# EAGLE design battery_charger (EAGLE 6.4)
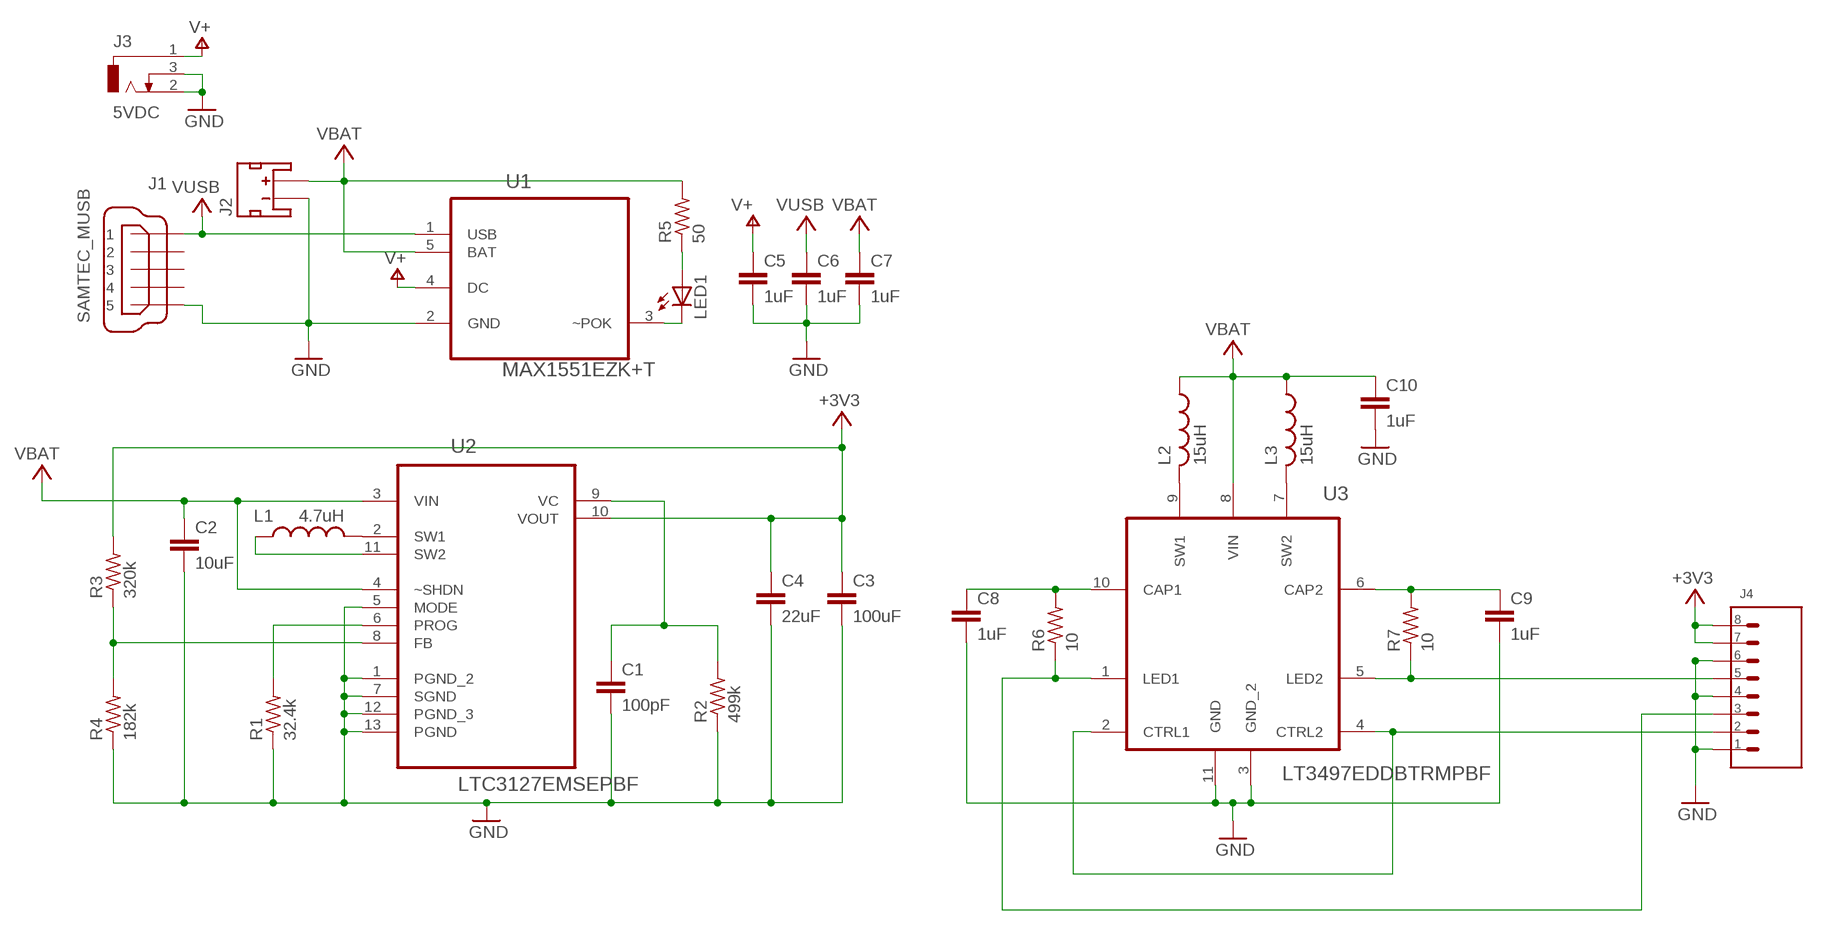
[diagram p0: schematic, sheet 1]

## Parts
C1  100pF  C-EUC0402  [C0402]
C2  10uF  C-EUC0402  [C0402]
C3  100uF  C-EUC1206  [C1206]
C4  22uF  C-EUC0805  [C0805]
C5  1uF  C-EUC0402  [C0402]
C6  1uF  C-EUC0402  [C0402]
C7  1uF  C-EUC0402  [C0402]
C8  1uF  C-EUC0805  [C0805]
C9  1uF  C-EUC0805  [C0805]
C10  1uF  C-EUC0402  [C0402]
J1  SAMTEC_MUSB  [MUSB-05-X-B-SM-A]
J2  JST_2MM_SMT  [JST_2MM_SMT]
J3  5VDC  DC_POWER_JACK_PJ-045  [PJ-045]
J4  IO  8PIN_SIP_.100IN  [8-PIN_SIP_.100IN]
L1  4.7uH  INDUCTOR_NR6028  [NR6028]
L2  15uH  L-USL3225M  [L3225M]
L3  15uH  L-USL3225M  [L3225M]
LED1  CHG  LEDCHIPLED_0603  [CHIPLED_0603]
R1  32.4k  R-US_R0402  [R0402]
R2  499k  R-US_R0402  [R0402]
R3  320k  R-US_R0402  [R0402]
R4  182k  R-US_R0402  [R0402]
R5  50  R-US_R0402  [R0402]
R6  10  R-US_R0402  [R0402]
R7  10  R-US_R0402  [R0402]
U1  MAX1551EZK+T  [SOT95P275X110-5N]
U2  LTC3127EMSEPBF  [SOP65P490X110-13N]
U3  LT3497EDDBTRMPBF  [DFN300X200X80-11N]

## Nets
+3V3: C3.1 C4.1 J4.7(S7) J4.8(S8) R3.2 U2.10(VOUT)
+VBAT: C2.1 C7.1 C10.1 J2.2(+) L2.1 L3.1 R5.2 U1.5(BAT) U2.3(VIN) U2.4(~SHDN) U3.8(VIN) ; supply symbol labelled VBAT
+VUSB: C6.1 J1.1 U1.1(USB) ; supply symbol labelled VUSB
GND: C1.2 C2.2 C3.2 C4.2 C5.2 C6.2 C7.2 C8.2 C9.2 C10.2 J1.5 J2.1(-) J3.2 J3.3 J4.1(S1) J4.4(S4) J4.6(S6) R1.1 R2.1 R4.1 U1.2(GND) U2.1(PGND_2) U2.5(MODE) U2.7(SGND) U2.12(PGND_3) U2.13(PGND) U3.3(GND_2) U3.11(GND)
N$1: R1.2 U2.6(PROG)
N$2: R3.1 R4.2 U2.8(FB)
N$3: L1.2 U2.2(SW1)
N$4: L1.1 U2.11(SW2)
N$5: LED1.C U1.3(~POK)
N$6: C8.1 R6.2 U3.10(CAP1)
N$7: C1.1 R2.2 U2.9(VC)
N$8: LED1.A R5.1
N$9: J4.3(S3) R6.1 U3.1(LED1)
N$10: J4.5(S5) R7.1 U3.5(LED2)
N$11: C9.1 R7.2 U3.6(CAP2)
N$12: L2.2 U3.9(SW1)
N$13: L3.2 U3.7(SW2)
N$14: J4.2(S2) U3.2(CTRL1) U3.4(CTRL2)
V+: C5.1 J3.1 U1.4(DC)
Unconnected: J1.2 J1.3 J1.4

## Library data of the parts
C1-C10 = rcl:C-EU: CAPACITOR, European symbol
J1 = Custom:SAMTEC_MUSB
J2 = Custom:JST_2MM_SMT
J3 = Custom:DC_POWER_JACK_PJ-045
J4 = Custom:8PIN_SIP_.100IN
L1 = Custom:INDUCTOR_NR6028
L2 L3 = rcl:L-US: INDUCTOR, American symbol
LED1 = led:LED: LED OSRAM: - CHIPLED LG R971, LG N971, LY N971, LG Q971, LY Q971, LO R971, LY R971 LH N974, LH R974 LS Q976, LO Q976, LY Q976 LO Q996 - Hyper CHIPLED LW Q18S LB Q993, LB Q99A, LB R99A - SideLED LS A670, LO A670, LY A670, LG A670, LP A670 LB A673, LV A673, LT A673, LW A673 LH A674 LY A675 LS A676, LA A676, LO A676, LY A676, LW A676 LS A679, LY A679, LG A679 - Hyper Micro SIDELED® LS Y876, LA Y876, LO Y876, LY Y876 LT Y87S - SmartLED LW L88C, LW L88S LB L89C, LB L89S, LG L890 LS L89K, LO L89K, LY L89K LS L896, LA L896, LO L896, LY L896 - TOPLED LS T670, LO T670, LY T670, LG T670, LP T670 LSG T670, LSP T670, LSY T670, LOP T670, LYG T670 LG T671, LOG T671, LSG T671 LB T673, LV T673, LT T673, LW T673 LH T674 LS T676, LA T676, LO T676, LY T676, LB T676, LH T676, LSB T676, LW T676 LB T67C, LV T67C, LT T67C, LS T67K, LO T67K, LY T67K, LW E67C LS E67B, LA E67B, LO E67B, LY E67B, LB E67C, LV E67C, LT E67C LW T67C LS T679, LY T679, LG T679 LS T770, LO T770, LY T770, LG T770, LP T770 LB T773, LV T773, LT T773, LW T773 LH T774 LS E675, LA E675, LY E675, LS T675 LS T776, LA T776, LO T776, LY T776, LB T776 LHGB T686 LT T68C, LB T68C - Hyper Mini TOPLED® LB M676 - Mini TOPLED Santana® LG M470 LS M47K, LO M47K, LY M47K Source: http://www.osram.convergy.de LUXEON: - LUMILED® LXK2-PW12-R00, LXK2-PW12-S00, LXK2-PW14-U00, LXK2-PW14-V00 LXK2-PM12-R00, LXK2-PM12-S00, LXK2-PM14-U00 LXK2-PE12-Q00, LXK2-PE12-R00, LXK2-PE12-S00, LXK2-PE14-T00, LXK2-PE14-U00 LXK2-PB12-K00, LXK2-PB12-L00, LXK2-PB12-M00, LXK2-PB14-N00, LXK2-PB14-P00, LXK2-PB14-Q00 LXK2-PR12-L00, LXK2-PR12-M00, LXK2-PR14-Q00, LXK2-PR14-R00 LXK2-PD12-Q00, LXK2-PD12-R00, LXK2-PD12-S00 LXK2-PH12-R00, LXK2-PH12-S00 LXK2-PL12-P00, LXK2-PL12-Q00, LXK2-PL12-R00 Source: www.luxeon.com KINGBRIGHT: KA-3528ASYC Source: www.kingbright.com
R1-R7 = rcl:R-US_: RESISTOR, American symbol
U1 = Maxim:MAX1551EZK+T: SOT23 Dual-Input USB/AC Adapter 1-Cell Li+ Battery Chargers; MPN: MAX1551EZK+T; OC_FARNELL: 1628221; OC_NEWARK: 59J2760; PACKAGE: SOT-23-5; SUPPLIER: Maxim
U2 = LTC:LTC3127EMSEPBF: 1A Buck-Boost DC/DC Converter with Programmable Input Current Limit; MANUFACTURER: LTC3127EMSE#PBF; OC_FARNELL: 1801165; OC_NEWARK: 67R4282; PACKAGE: MSOP-12; SUPPLIER: Linear Technology
U3 = LTC:LT3497EDDBTRMPBF: Dual Full Function White LED Driver with Integrated Schottky Diodes; MPN: LT3497EDDB#TRMPBF; OC_FARNELL: 1715222; OC_NEWARK: 88M1943; PACKAGE: DFN-10; SUPPLIER: Linear Technology

## Board
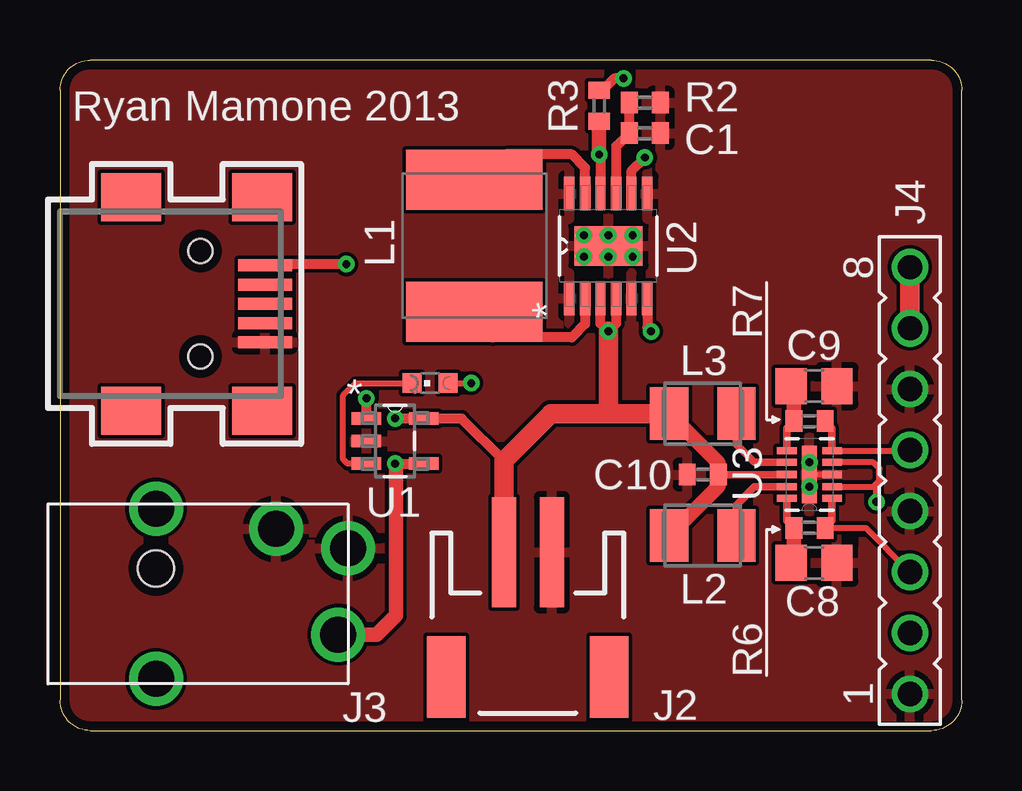
[diagram p1: board, top side]
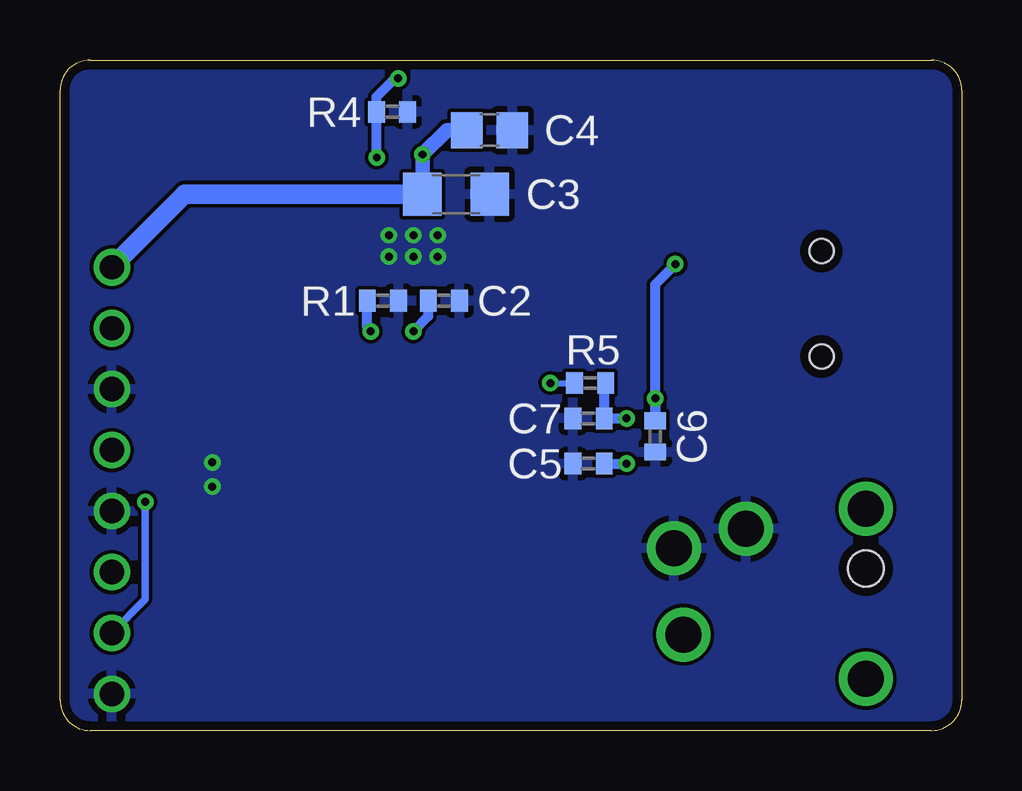
[diagram p2: board, bottom side, seen from below]

Size 37.59 x 27.94 mm. Coordinates in mm from the lower left corner, seen from the top.
Outline: 1.27,0 36.32,0 arc90 37.59,1.27 37.59,26.67 arc90 36.32,27.94 1.27,27.94 arc90 0,26.67 0,1.27 arc90 1.27,0
Copper layers (1*16): Top 0.0356mm / dielectric 1.5011mm / Bottom 0.0356mm
Design rules "LaenPCBOrder_tented_vias": minimum track width 6mil, minimum drill 13mil, track to track 6mil, track to pad 6mil, pad to pad 6mil, via to via 6mil, smd to smd 6mil, copper to edge 15mil, drill to drill 6mil, minimum pad ring 7mil, minimum via ring 7mil, stop-mask expansion 4mil, vias tented up to drill 13mil, thermal gap 10mil

### Footprints (pad centres in the part's own frame; a part is rotated, then mirrored left to right if it is on the bottom)
C0402 = smd 0.7 x 0.9: 1 -0.65,0; 2 0.65,0
C1206 = smd 1.6 x 1.8: 1 -1.4,0; 2 1.4,0
C0805 = smd 1.3 x 1.5: 1 -0.95,0; 2 0.95,0
MUSB-05-X-B-SM-A = smd 0.5 x 2.25: 1 -1.6,8.545; 2 -0.8,8.545; 3 0,8.545; 4 0.8,8.545; 5 1.6,8.545 | smd 2 x 2.5: 8 -4.45,2.97; 9 4.45,2.97; 10 -4.45,8.42; 11 4.45,8.42 | hole 1: -2.2,5.85; 2.2,5.85
JST_2MM_SMT = smd 1 x 4.6: 1 -1,-2.43; 2 1,-2.43 | smd 1.6 x 3.4: NC1 -3.4,2.77; NC2 3.4,2.77
PJ-045 = drill 1.5: 1 1,2.6; 2 -3.4,0; 3 -2.6,3; 4 -4.25,-5; 5 2.85,-5 | hole 1.5: -1.75,-5
8-PIN_SIP_.100IN = drill 1.016: 1 -8.89,0; 2 -6.35,0; 3 -3.81,0; 4 -1.27,0; 5 1.27,0; 6 3.81,0; 7 6.35,0; 8 8.89,0
NR6028 = smd 2.5 x 5.7: 1 -2.75,0; 2 2.75,0
L3225M = smd 1.6 x 2.2: 1 -1.4,0; 2 1.4,0
CHIPLED_0603 = smd 0.8 x 0.8: A 0,-0.75; C 0,0.75
R0402 = smd 0.7 x 0.9: 1 -0.65,0; 2 0.65,0
SOT95P275X110-5N = smd 1.219 x 0.508: 1 -1.194,0.94; 2 -1.194,0; 3 -1.194,-0.94; 4 1.194,-0.94; 5 1.194,0.94
SOP65P490X110-13N = smd 1.397 x 0.432: 1 -2.184,1.626; 2 -2.184,0.965; 3 -2.184,0.33; 4 -2.184,-0.33; 5 -2.184,-0.965; 6 -2.184,-1.626; 7 2.184,-1.626; 8 2.184,-0.965; 9 2.184,-0.33; 10 2.184,0.33; 11 2.184,0.965; 12 2.184,1.626 | smd 1.651 x 2.845: 13 0,0
DFN300X200X80-11N = smd 0.813 x 0.305: 1 -0.94,0.991; 2 -0.94,0.508; 3 -0.94,0; 4 -0.94,-0.508; 5 -0.94,-0.991; 6 0.94,-0.991; 7 0.94,-0.508; 8 0.94,0; 9 0.94,0.508; 10 0.94,0.991 | smd 0.635 x 2.388: 11 0,0

### Placement (x,y rotation side)
C1  24.38,24.89 0 top
C2  21.59,17.91 0 bottom
C3  21.08,22.35 0 bottom
C4  19.68,25.02 0 bottom
C5  15.56,11.13 180 bottom
C6  12.78,12.26 270 bottom
C7  15.56,13 180 bottom
C8  31.43,6.99 0 top
C9  31.43,14.35 0 top
C10  26.8,10.67 180 top
J1  0,17.78 270 top
J2  19.5,5 180 top
J3  9,5 270 top
J4  35.43,10.41 90 top
L1  17.27,20.19 270 top
L2  26.8,8.13 0 top
L3  26.8,13.21 0 top
LED1  15.43,14.48 90 top
R1  24.13,17.91 180 bottom
R2  24.38,26.16 180 top
R3  22.48,26.04 270 top
R4  23.75,25.78 180 bottom
R5  15.49,14.48 0 bottom
R6  31.24,8.45 180 top
R7  31.24,12.89 180 top
U1  13.97,12.06 0 top
U2  22.86,20.19 90 top
U3  31.24,10.67 180 top

### Tracks (layer width: path | path; a pad name or v marks a point on that pad's centre or on a via)
+3V3  (via drill 0.33)
  Top 0.406: v22.48,24 22.53,23.95 U2.10
  Top 0.61: R3.2 v22.48,24
  Top 0.813: J4.8 J4.7
  Bottom 0.406: C3.1
  Bottom 0.61: C3.1 v22.48,24 21.46,25.02 C4.1
  Bottom 0.813: C3.1 32.38,22.35 J4.8
+VBAT  (via drill 0.33)
  Top 0.305: U3.8 C10.1 | C10.1 27.45,11.16 | C10.1 27.45,10.18
  Top 0.406: v13.97,13.01 U1.5 16.74,13 18.5,11.24 | U2.4 23.19,16.97 v22.86,16.64 22.53,16.97 U2.3
  Top 0.61: 27.45,11.16 L3.1 | 27.45,10.18 L2.1
  Top 0.813: J2.2 18.5,11.24 20.47,13.21 22.86,13.21 | v22.86,16.64 22.86,13.21 | L3.1 22.86,13.21
  Bottom 0.406: v13.97,13.01 C7.1 14.91,14.41 R5.2 | C2.1 22.24,17.26 v22.86,16.64
+VUSB  (via drill 0.33)
  Top 0.406: U1.1 v12.78,13.84 | v11.94,19.43 8.6,19.43 J1.1
  Bottom 0.406: v12.78,13.84 C6.1 12.78,18.59 v11.94,19.43
GND  (via drill 0.33, 0.33 pad 0.25)
  Top 0.254: U3.3 U3.11 v31.24,10.16
  Top 0.61: v22.86,19.75 U2.13
  other vias: 31.24,11.18 22.86,20.64 21.84,19.75 21.84,20.64 23.88,19.75 23.88,20.64
  pour Bottom (rank 6): 0,27.94 37.59,27.94 37.59,0 0,0
  pour Top (rank 6): 0,27.94 37.59,27.94 37.59,0 0,0
N$1  (via drill 0.33)
  Top 0.406: U2.6 24.49,16.79 v24.64,16.64
  Bottom 0.406: v24.64,16.64 24.78,16.78 R1.2
N$2  (via drill 0.33)
  Top 0.406: U2.8 23.82,23.32 v24.38,23.88 | 22.62,26.8 R3.1 22.61,26.67 23.11,27.18 v23.5,27.18
  Bottom 0.406: v23.5,27.18 23.75,27.05 24.4,26.4 R4.2 24.38,25.39 v24.38,23.88
N$3
  Top 0.406: U2.2 21.89,16.94 21.34,16.38 18.03,16.38 17.53,16.89 L1.2
N$4
  Top 0.406: U2.11 21.89,23.44 21.34,24 18.59,24 L1.1
N$5
  Top 0.254: U1.3 11.99,11.12 11.81,11.3 11.81,13.97 12.32,14.48 LED1.C
N$6
  Top 0.254: 30.3,8.73 R6.2
  Top 0.305: U3.10 30.3,8.73
  Top 0.61: R6.2 30.59,7.12 C8.1
N$7
  Top 0.406: U2.9 23.19,24.35 C1.1 R2.2
N$8  (via drill 0.33)
  Top 0.254: LED1.A v17.14,14.48
  Bottom 0.254: v17.14,14.48 R5.1
N$9
  Top 0.254: 32.18,8.73 R6.1 33.59,8.45 J4.3
  Top 0.305: U3.1 32.18,8.73
N$10
  Top 0.254: 32.18,12.6 R7.1 | U3.5 35.46,11.66 J4.5
  Top 0.305: U3.5 32.18,12.6
N$11
  Top 0.254: 30.3,12.6 R7.2
  Top 0.305: U3.6 30.3,12.6
  Top 0.61: R7.2 30.59,14.21 C9.1
N$12
  Top 0.305: U3.9 28.96,10.16 28.19,9.4 28.2,9.39 L2.2
N$13
  Top 0.305: U3.7 28.96,11.18 28.19,11.94 L3.2
N$14  (via drill 0.33)
  Top 0.254: U3.2 33.91,10.16 | 33.91,10.16 34.16,10.41 34.16,10.92 33.91,11.18 U3.4 | v34.04,9.53 34.04,10.16 33.91,10.16
  Bottom 0.305: J4.2 34.04,5.46 v34.04,9.53
N$18
  pour Top (isolate 0.61): 30.73,12.06 31.75,12.06 31.75,9.27 30.73,9.27
  pour Top (isolate 0.61): 32.64,10.41 32.64,10.92 33.91,10.92 33.91,10.41
  pour Top (isolate 0.61): 21.34,18.92 21.34,21.46 24.38,21.46 24.38,18.92
V+  (via drill 0.33)
  Top 0.406: v13.97,11.12 U1.4
  Top 0.61: J3.1 13.2,4 14,4.8 14,11.1 v13.97,11.12
  Bottom 0.406: C5.1 v13.97,11.12

### Text on the board
tNames: Ryan Mamone 2013